# Altium schematic sheet DAC.SchDoc
size A
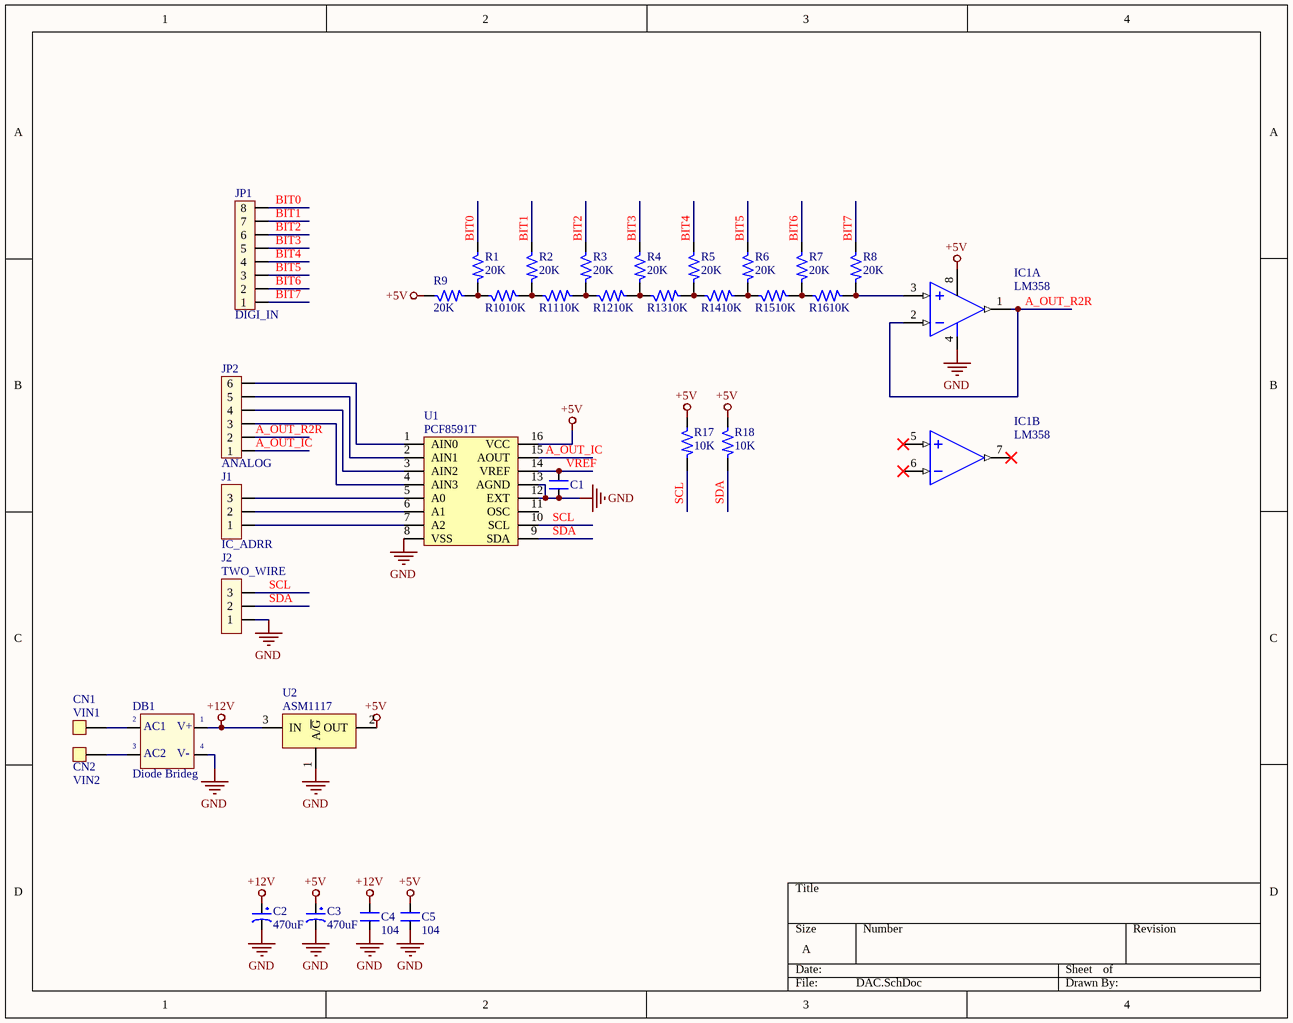
[diagram p0: DAC.SchDoc]

## Parts
C1  104  [C-0805]  (value not drawn)
C2  470uF  [C-ALU-D6.5]
C3  470uF  [C-ALU-D6.5]
C4  104  [C-0805]
C5  104  [C-0805]
CN1  VIN1  [M3]
CN2  VIN2  [M3]
DB1  Diode Brideg  [D-DB-1A-SMD]
IC1  LM358  [SOP-8]  (parts A,B of 2)
J1  IC_ADRR  [JP3]
J2  TWO_WIRE  [JP3]
JP1  DIGI_IN  [JP8]
JP2  ANALOG  [JP6]
R1  20K  [R-0805]
R2  20K  [R-0805]
R3  20K  [R-0805]
R4  20K  [R-0805]
R5  20K  [R-0805]
R6  20K  [R-0805]
R7  20K  [R-0805]
R8  20K  [R-0805]
R9  20K  [R-0805]
R10  10K  [R-0805]
R11  10K  [R-0805]
R12  10K  [R-0805]
R13  10K  [R-0805]
R14  10K  [R-0805]
R15  10K  [R-0805]
R16  10K  [R-0805]
R17  10K  [R-0805]
R18  10K  [R-0805]
U1  PCF8591T  [SO-16]
U2  ASM1117  [TO-252]

## Nets
+5V: C3.1 C5.2 IC1.8(+V) R9.1 R17.1 R18.1 U1.16(VCC) U2.2(OUT)
+12V: C2.1 C4.2 DB1.3(AC2) U2.3(IN)
GND: C1.1 C2.2 C3.2 C4.1 C5.1 DB1.4(-V_OUT) IC1.4(-V) J2.1 U1.8(VSS) U1.12(EXT) U1.13(AGND) U2.1(A/~{G})
A_OUT_IC: JP2.1 U1.15(AOUT)
A_OUT_R2R: IC1.1(OUT) IC1.2(IN-) JP2.2
BIT0: JP1.8 R1.1
BIT1: JP1.7 R2.1
BIT2: JP1.6 R3.1
BIT3: JP1.5 R4.1
BIT4: JP1.4 R5.1
BIT5: JP1.3 R6.1
BIT6: JP1.2 R7.1
BIT7: JP1.1 R8.1
SCL: J2.3 R17.2 U1.10(SCL)
SDA: J2.2 R18.2 U1.9(SDA)
VREF: C1.2 U1.14(VREF)
NetCN1_1: CN1.1 DB1.2(AC1)
NetCN2_1: CN2.1 DB1.1(+V_OUT)
NetIC1_3: IC1.3(IN+) R8.2 R16.2
NetJ1_1: J1.1 U1.7(A2)
NetJ1_2: J1.2 U1.6(A1)
NetJ1_3: J1.3 U1.5(A0)
NetJP2_3: JP2.3 U1.4(AIN3)
NetJP2_4: JP2.4 U1.3(AIN2)
NetJP2_5: JP2.5 U1.2(AIN1)
NetJP2_6: JP2.6 U1.1(AIN0)
NetR1_2: R1.2 R9.2 R10.1
NetR2_2: R2.2 R10.2 R11.1
NetR3_2: R3.2 R11.2 R12.1
NetR4_2: R4.2 R12.2 R13.1
NetR5_2: R5.2 R13.2 R14.1
NetR6_2: R6.2 R14.2 R15.1
NetR7_2: R7.2 R15.2 R16.1

Not connected (* = marked no-connect by the designer): IC1 5(IN+)* 6(IN-)* 7(OUT)*; U1 11(OSC)

## Notes on the sheet
- (in symbol DB) V+; V-

## Library data of the parts
C1 C4 C5 = CN: Value: 0,1uF/300V; Designed by: VanDungEvn
C2 C3 = CP1: Cap P  0,1uF < 22uF , 16 - 50V; Value: 10uF/50V; Description 1: 10 => 220uF/6,3V/10V - 10uF => 100uF/16V; Description 2: 0,1uF => 33uF/50V - 10uF => 22uF/63V; Description 3: 0,47uF => 10uF/100V
CN1 CN2 = COCDONGM3: Value: M3
DB1 = DB: Convert AC to DC voltage, 4 pin; Value: Cau 1A
IC1 = LM358: Low-Power Dual Operational Amplifier; Value: LM358
J1 J2 = JP3: Jumper 3; Value: J3
JP1 = JP8: JP8 PIN; Value: JP7
JP2 = JP6: JP6 PIN; Value: JP7
R1-R18 = R: Resistor 1/4W; Value: R1/4W - 1K
U1 = PCF8591T: Value: PCF8591T